# EAGLE design Groupe3_Hermant-Bohyn-Almasy-Ponjee (EAGLE 9.3.0)
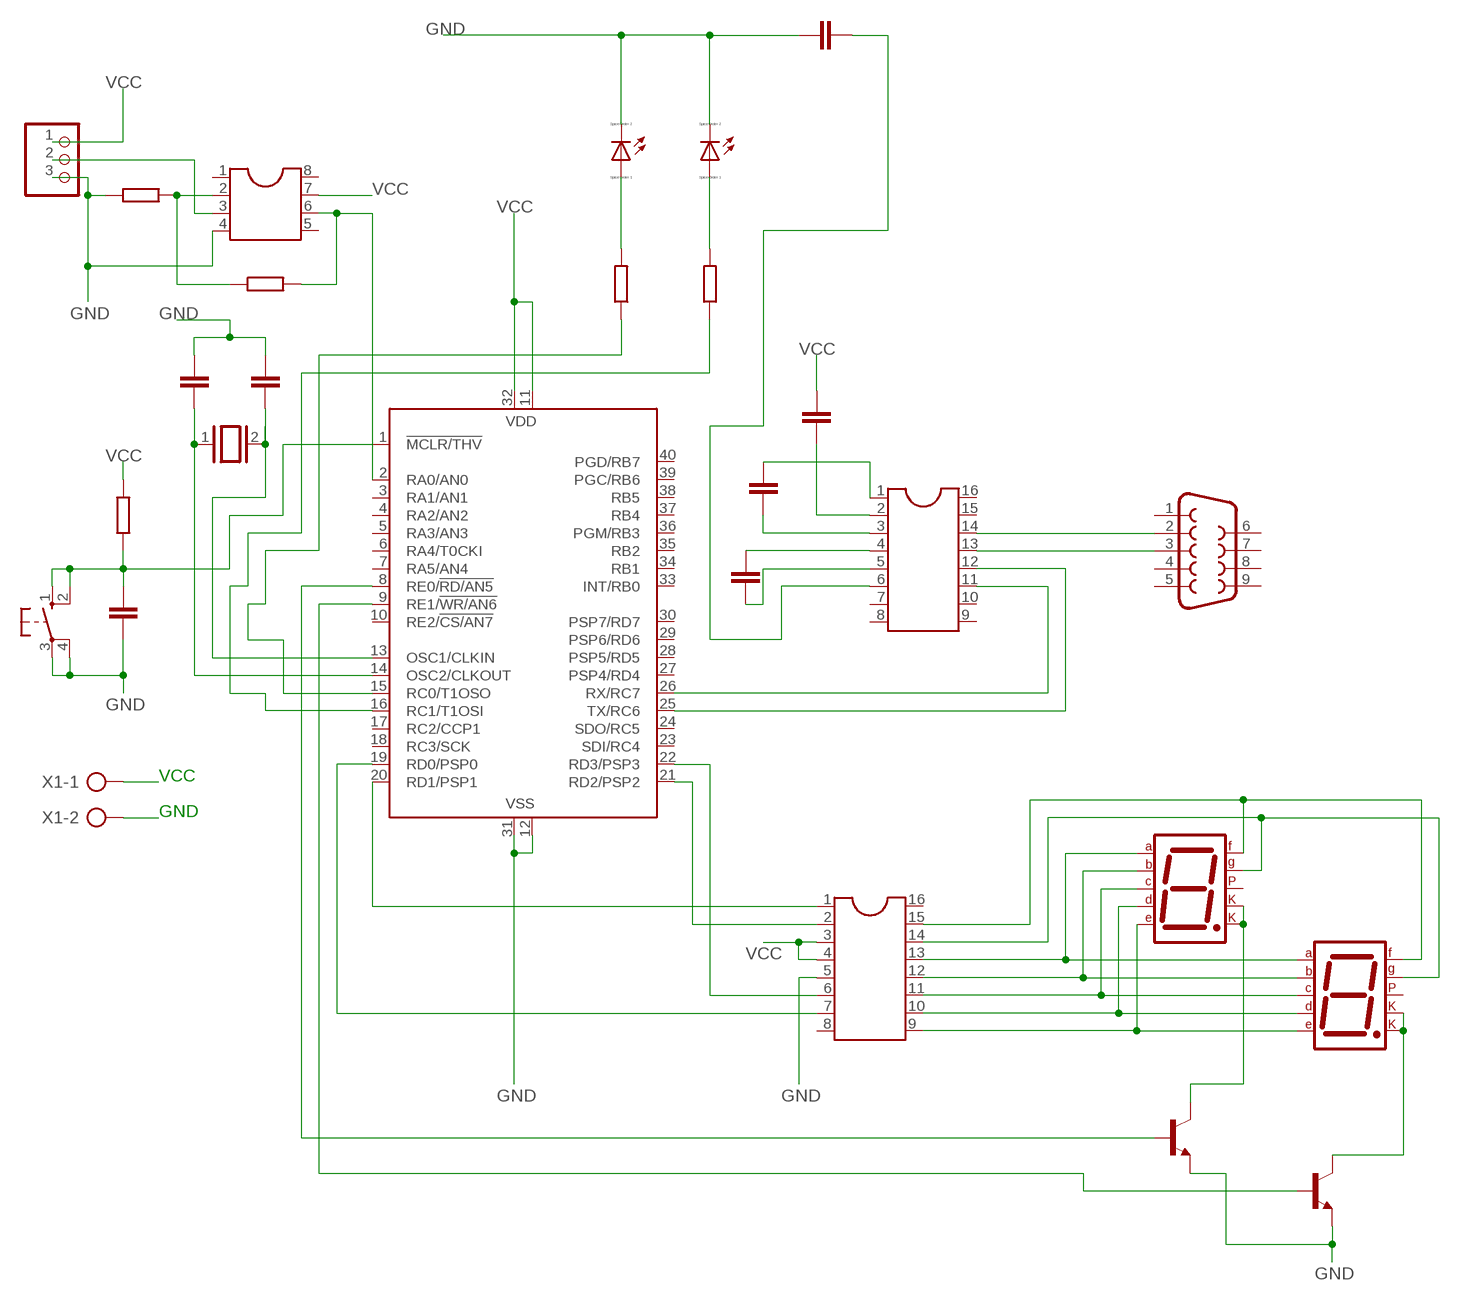
[diagram p0: schematic, sheet 1]

## Parts
4511  DIL16  [DIL16]
AMPLIOP  DIL8  [DIL08]
C1  15pF  C-EU025-050X050  [C025-050X050]
C2  15pF  C-EU025-050X050  [C025-050X050]
C3  1uF  C-EU025-050X050  [C025-050X050]
C4  10uF  C-EU025-050X050  [C025-050X050]
C5  10uF  C-EU025-050X050  [C025-050X050]
C7  100u  C-EU025-050X050  [C025-050X050]
C61  10uF  C-EU025-050X050  [C025-050X050]
D1  7SEG-CK  [7SEG-13]
D2  7SEG-CK  [7SEG-13]
LED1  LED_ELD260  [LED_LD260]
LED2  LED_ELD260  [LED_LD260]
LM35  PINHD-1X3  [1X03]
MAX232  DIL16  [DIL16]
P1/COMPIM  F09V  [F09V]
Q1  2N2222  [TO18]
Q2  2N2222  [TO18]
R1  10k  R-EU_0204/7  [0204/7]
R2  4k  R-EU_0204/7  [0204/7]
R3  1k  R-EU_0204/7  [0204/7]
R4  280  R-EU_0204/7  [0204/7]
R5  280  R-EU_0204/7  [0204/7]
S1  10-XX  [B3F-10XX]
U1  PIC16F877P  [DIL40]
X1  AK300/2  [AK300/2]
X11  XTAL/S  [QS]

## Nets
COMPIM: 4511.12 D1.6(B) D2.6(B)
GND: 4511.5 AMPLIOP.4 C1.1 C2.1 C3.1 C61.2 LED1.K(C) LED2.K(C) LM35.3 Q1.1(E) Q2.1(E) R2.1 S1.3(P) S1.4(P1) U1.12(VSS) U1.31(VSS) X1.2
N$2: C2.2 U1.14(OSC2/CLKOUT) X11.1
N$5: MAX232.14 P1/COMPIM.2
N$6: LED2.A R5.2
N$8: C1.2 U1.13(OSC1/CLKIN) X11.2
N$9: 4511.1 U1.20(RD1/PSP1)
N$10: LED1.A R4.2
N$11: MAX232.13 P1/COMPIM.3
N$12: C61.1 MAX232.6
N$13: R4.1 U1.15(RC0/T1OSO)
N$14: R5.1 U1.16(RC1/T1OSI)
N$15: C7.1 MAX232.2
N$18: C4.1 MAX232.3
N$21: C4.2 MAX232.1
N$22: C5.2 MAX232.4
N$24: C5.1 MAX232.5
N$25: C3.2 R1.1 S1.1(S) S1.2(S1) U1.1(!MCLR/THV)
N$26: 4511.7 U1.19(RD0/PSP0)
N$27: D1.3(CK1) D1.8(CK2) Q1.3(C)
N$28: 4511.2 U1.21(RD2/PSP2)
N$29: 4511.6 U1.22(RD3/PSP3)
N$30: AMPLIOP.3 LM35.2
N$31: MAX232.12 U1.25(TX/RC6)
N$32: MAX232.11 U1.26(RX/RC7)
N$33: Q1.2(B) U1.8(RE0/!RD/AN5)
N$34: AMPLIOP.2 R2.2 R3.1
N$35: AMPLIOP.6 R3.2 U1.2(RA0/AN0)
N$36: 4511.13 D1.7(A) D2.7(A)
N$37: 4511.10 D1.2(D) D2.2(D)
N$38: 4511.11 D1.4(C) D2.4(C)
N$39: 4511.9 D1.1(E) D2.1(E)
N$44: 4511.14 D1.10(G) D2.10(G)
N$47: D2.3(CK1) D2.8(CK2) Q2.3(C)
N$48: Q2.2(B) U1.9(RE1/!WR/AN6)
N$53: 4511.15 D1.9(F) D2.9(F)
VCC: 4511.3 4511.4 AMPLIOP.7 C7.2 LM35.1 R1.2 U1.11(VDD) U1.32(VDD) X1.1
Unconnected: 4511.8 4511.16 AMPLIOP.1 AMPLIOP.5 AMPLIOP.8 D1.5(DP) D2.5(DP) MAX232.7 MAX232.8 MAX232.9 MAX232.10 MAX232.15 MAX232.16 P1/COMPIM.1 P1/COMPIM.4 P1/COMPIM.5 P1/COMPIM.6 P1/COMPIM.7 P1/COMPIM.8 P1/COMPIM.9 U1.3(RA1/AN1) U1.4(RA2/AN2) U1.5(RA3/AN3) U1.6(RA4/T0CKI) U1.7(RA5/AN4) U1.10(RE2/!CS/AN7) U1.17(RC2/CCP1) U1.18(RC3/SCK) U1.23(SDI/RC4) U1.24(SDO/RC5) U1.27(PSP4/RD4) U1.28(PSP5/RD5) U1.29(PSP6/RD6) U1.30(PSP7/RD7) U1.33(INT/RB0) U1.34(RB1) U1.35(RB2) U1.36(PGM/RB3) U1.37(RB4) U1.38(RB5) U1.39(PGC/RB6) U1.40(PGD/RB7)

## Library data of the parts
4511 MAX232 = ic-package:DIL16: Dual In Line / Socket
AMPLIOP = ic-package:DIL8: Dual In Line / Socket
C1-C5 C7 C61 = rcl:C-EU: CAPACITOR, European symbol
D1 D2 = special:7SEG-CK: 7-segment DISPLAY single cathode, 13 mm
LED1 LED2 = eagle-ltspice:LED_E: LED Source: http://www.osram.convergy.de Source: www.luxeon.com Source: www.kingbright.com; SPICEMODEL: NONE; SPICEPREFIX: D; SPICETYPE: diode
LM35 = pinhead:PINHD-1X3: PIN HEADER
P1/COMPIM = con-subd:F09: SUB-D; OC_FARNELL: unknown; OC_NEWARK: unknown
Q1 Q2 = transistor:2N2222: NPN TRANSISTOR
R1-R5 = rcl:R-EU_: RESISTOR, European symbol
S1 = switch-omron:10-XX: OMRON SWITCH; MPN: B3F-1000; OC_FARNELL: 176432; OC_NEWARK: 36M3542
U1 = microchip:PIC16F87*: MICROCONTROLLER; MF: MICROCHIP; MPN: PIC16F877-04/P; OC_FARNELL: 9761349; OC_NEWARK: 61K3463
X1 = con-ptr500:AK300/2: CONNECTOR; OC_FARNELL: unknown; OC_NEWARK: unknown
X11 = special:XTAL/S: CRYSTAL

## Board
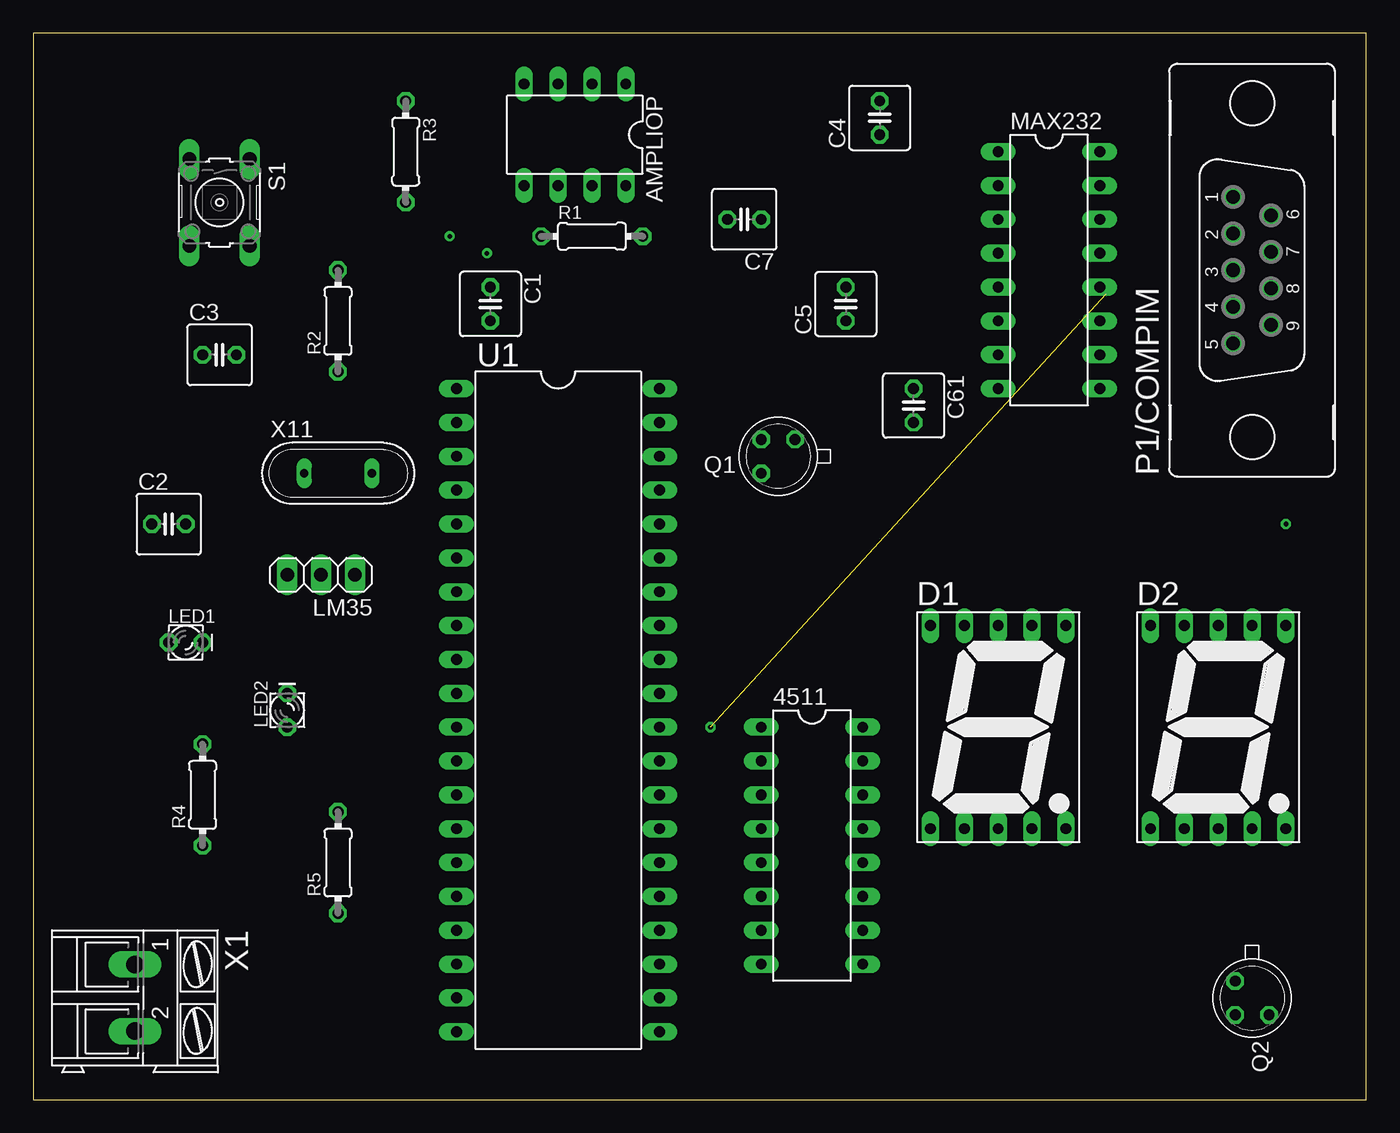
[diagram p1: board, top side]
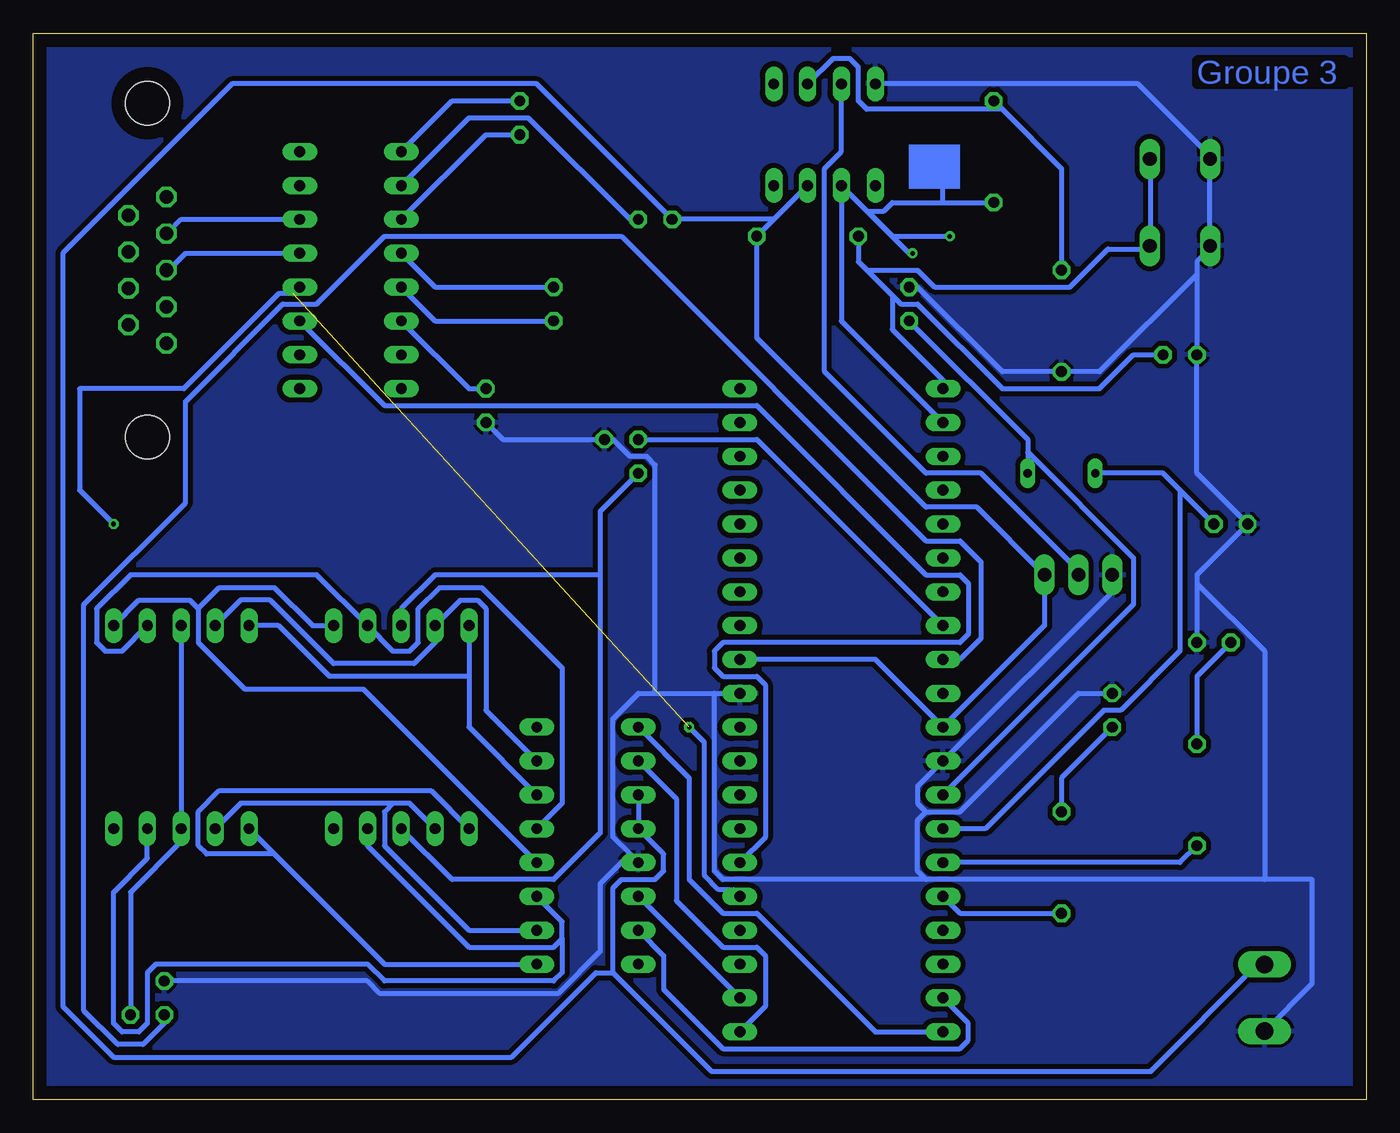
[diagram p2: board, bottom side, seen from below]

Size 100 x 80 mm. Coordinates in mm from the lower left corner, seen from the top.
Outline: 0,0 100,0 100,80 0,80 0,0
Copper layers (1*16): Top 0.035mm / dielectric 1.5mm / Bottom 0.035mm
Design rules "default *": minimum track width 15mil, minimum drill 0.35mm, track to track 15mil, track to pad 15mil, pad to pad 15mil, via to via 15mil, smd to smd 6mil, copper to edge 40mil, drill to drill 6mil, minimum pad ring 10mil, minimum via ring 8mil, stop-mask expansion 4mil, vias tented up to drill 0mil, thermal gap 10mil

### Footprints (pad centres in the part's own frame; a part is rotated, then mirrored left to right if it is on the bottom)
DIL16 = drill 0.813 long: 1 -8.89,-3.81; 2 -6.35,-3.81; 3 -3.81,-3.81; 4 -1.27,-3.81; 5 1.27,-3.81; 6 3.81,-3.81; 7 6.35,-3.81; 8 8.89,-3.81; 9 8.89,3.81; 10 6.35,3.81; 11 3.81,3.81; 12 1.27,3.81; 13 -1.27,3.81; 14 -3.81,3.81; 15 -6.35,3.81; 16 -8.89,3.81
DIL08 = drill 0.813 long: 1 -3.81,-3.81; 2 -1.27,-3.81; 3 1.27,-3.81; 4 3.81,-3.81; 5 3.81,3.81; 6 1.27,3.81; 7 -1.27,3.81; 8 -3.81,3.81
C025-050X050 = drill 0.813 octagon: 1 -1.27,0; 2 1.27,0
7SEG-13 = drill 0.813 long: 1 -5.08,-7.62; 2 -2.54,-7.62; 3 0,-7.62; 4 2.54,-7.62; 5 5.08,-7.62; 6 5.08,7.62; 7 2.54,7.62; 8 0,7.62; 9 -2.54,7.62; 10 -5.08,7.62
LED_LD260 = drill 0.813 octagon: A -1.27,0; K 1.27,0
1X03 = drill 1.016 long: 1 -2.54,0; 2 0,0; 3 2.54,0
F09V = drill 1.016 octagon: 1 5.486,1.422; 2 2.743,1.422; 3 0,1.422; 4 -2.743,1.422; 5 -5.486,1.422; 6 4.115,-1.422; 7 1.372,-1.422; 8 -1.372,-1.422; 9 -4.115,-1.422 | hole 3.302: -12.522,0; 12.522,0
TO18 = drill 0.813 octagon: 1 -1.27,-1.27; 2 1.27,-1.27; 3 1.27,1.27
0204/7 = drill 0.813 octagon: 1 -3.81,0; 2 3.81,0
B3F-10XX = drill 1.016 long: 1 -3.251,2.261; 2 3.251,2.261; 3 -3.251,-2.261; 4 3.251,-2.261
DIL40 = drill 0.813 long: 1 -24.13,-7.62; 2 -21.59,-7.62; 3 -19.05,-7.62; 4 -16.51,-7.62; 5 -13.97,-7.62; 6 -11.43,-7.62; 7 -8.89,-7.62; 8 -6.35,-7.62; 9 -3.81,-7.62; 10 -1.27,-7.62; 11 1.27,-7.62; 12 3.81,-7.62; 13 6.35,-7.62; 14 8.89,-7.62; 15 11.43,-7.62; 16 13.97,-7.62; 17 16.51,-7.62; 18 19.05,-7.62; 19 21.59,-7.62; 20 24.13,-7.62; 21 24.13,7.62; 22 21.59,7.62; 23 19.05,7.62; 24 16.51,7.62; 25 13.97,7.62; 26 11.43,7.62; 27 8.89,7.62; 28 6.35,7.62; 29 3.81,7.62; 30 1.27,7.62; 31 -1.27,7.62; 32 -3.81,7.62; 33 -6.35,7.62; 34 -8.89,7.62; 35 -11.43,7.62; 36 -13.97,7.62; 37 -16.51,7.62; 38 -19.05,7.62; 39 -21.59,7.62; 40 -24.13,7.62
AK300/2 = drill 1.321 long: 1 -2.515,0; 2 2.489,0
QS = drill 0.61 long: 1 -2.54,0; 2 2.54,0

### Placement (x,y rotation side)
4511  58.42,19.05 270 top
AMPLIOP  40.64,72.39 180 top
C1  34.29,59.69 270 top
C2  10.16,43.18 0 top
C3  13.97,55.88 0 top
C4  63.5,73.66 90 top
C5  60.96,59.69 90 top
C7  10uF  [C025-050X050]  53.34,66.04 180 top
C61  66.04,52.07 270 top
D1  72.39,27.94 0 top
D2  88.9,27.94 0 top
LED1  11.43,34.29 0 top
LED2  19.05,29.21 90 top
LM35  21.59,39.37 180 top
MAX232  76.2,62.23 270 top
P1/COMPIM  91.44,62.23 90 top
Q1  55.88,48.26 180 top
Q2  91.44,7.62 270 top
R1  41.91,64.77 0 top
R2  22.86,58.42 90 top
R3  27.94,71.12 270 top
R4  12.7,22.86 90 top
R5  22.86,17.78 90 top
S1  13.97,67.31 270 top
U1  39.37,29.21 270 top
X1  7.62,7.62 270 top
X11  22.86,46.99 0 top

### Tracks (layer width: path | path; a pad name or v marks a point on that pad's centre or on a via)
COMPIM
  Bottom 0.381: 4511.12 75.25,30.8 84.14,30.8 87.63,34.29 87.63,36.83 | 87.63,36.83 88.27,37.47 92.08,37.47 D2.6 | D1.6 79.06,35.56 81.92,38.42 86.04,38.42 87.63,36.83
GND
  Bottom 0.381: C61.2 64.77,49.53 Q1.1 56.52,49.53 55.24,48.26 53.98,48.26 53.34,47.62 53.34,30.48 | 53.34,30.48 54.61,30.48 56.52,28.57 56.52,19.68 55.24,18.41 | 53.34,30.48 48.9,30.48 | 48.9,30.48 U1.31 | Q2.1 74.93,8.89 73.98,7.94 60.64,7.94 57.47,11.11 57.47,16.19 55.24,18.41 | 55.24,18.41 4511.5 | AMPLIOP.4 17.14,76.2 11.75,70.8 S1.3 11.75,70.48 11.75,64.14 S1.4 11.75,63.82 12.7,62.87 12.7,61.91 | 12.7,61.91 C3.1 12.7,46.99 C2.1 12.7,39.37 12.7,38.73 | 12.7,61.91 20,54.61 R2.1 27.3,54.61 33.66,60.96 C1.1 | LM35.3 19.05,38.1 U1.12 33.66,23.5 33.66,22.23 33.02,21.59 | LED2.K 21.59,30.48 30.48,21.59 33.02,21.59 | 12.7,38.73 LED1.K | 7.62,16.51 7.62,33.66 12.7,38.73 | X1.2 4.06,8.69 4.06,16.51 7.62,16.51 | 33.02,21.59 33.66,20.95 33.66,17.14 33.02,16.51 | 7.62,16.51 33.02,16.51 | 48.9,30.48 48.9,17.14 48.26,16.51 33.02,16.51
  pour Bottom (isolate 0.02): 0,80.01 100.08,80.01 100.08,0 0,0
N$2
  Bottom 0.381: X11.1 15.24,46.99 13.97,45.72 | C2.2 13.97,45.72 | U1.14 28.57,20.32 19.68,29.21 18.41,29.21 13.97,33.66 13.97,45.72
N$5
  Bottom 0.381: MAX232.14 88.9,66.04 89.85,65.09 P1/COMPIM.2
N$6
  Bottom 0.381: R5.2 22.86,24.13 LED2.A
N$8
  Bottom 0.381: 25.4,48.58 25.4,49.53 C1.2 | 25.4,48.58 X11.2 | U1.13 17.46,37.15 17.46,40.64 25.4,48.58
N$9
  Bottom 0.381: U1.20 36.83,5.08 45.72,13.97 48.26,13.97 50.8,16.51 50.8,24.13 4511.1
N$10
  Bottom 0.381: R4.2 12.7,31.75 LED1.A
N$11
  Bottom 0.381: MAX232.13 88.58,63.5 89.85,62.23 P1/COMPIM.3
N$12
  Bottom 0.381: C61.1 67.31,53.34 MAX232.6
N$13
  Bottom 0.381: U1.15 13.97,17.78 R4.1
N$14
  Bottom 0.381: R5.1 30.48,13.97 U1.16
N$15
  Bottom 0.381: C7.1 55.24,66.04 62.87,73.66 67.31,73.66 MAX232.2
N$18
  Bottom 0.381: C4.1 66.04,72.39 MAX232.3
N$21
  Bottom 0.381: C4.2 68.58,74.93 MAX232.1
N$22
  Bottom 0.381: C5.2 69.85,60.96 MAX232.4
N$24
  Bottom 0.381: C5.1 69.85,58.42 MAX232.5
N$25
  Bottom 0.381: S1.1 16.19,70.48 16.19,64.14 S1.2 16.51,63.82 19.37,63.82 22.23,60.96 32.38,60.96 33.66,62.23 37.47,62.23 | C3.2 17.46,55.88 20,53.34 27.3,53.34 33.66,59.69 34.92,59.69 35.56,60.33 | 37.47,62.23 38.1,62.87 R1.1 | 37.47,62.23 35.56,60.33 | U1.1 31.75,53.98 35.56,57.78 35.56,60.33
N$26
  Bottom 0.381: U1.19 29.84,5.71 29.84,4.45 30.48,3.81 48.26,3.81 52.7,8.26 52.7,10.79 4511.7
N$27
  Bottom 0.381: D1.3 68.58,16.51 60.96,16.51 57.47,20 57.47,39.37 | 57.47,39.37 57.47,44.13 Q1.3 | D1.8 72.39,36.83 69.85,39.37 57.47,39.37
N$28
  Bottom 0.381: U1.21 45.09,6.99 45.09,10.79 45.72,11.43 48.26,11.43 51.75,14.92 51.75,22.54 4511.2
N$29
  Bottom 0.381: 4511.6 U1.22
N$30
  Bottom 0.381: AMPLIOP.3 39.37,71.12 40.64,69.85 40.64,54.61 33.02,46.99 28.89,46.99 21.59,39.69 LM35.2
N$31  (via drill 0.35)  (1 unrouted)
  Bottom 0.381: U1.25 47.5,15.75 48.58,15.75 49.66,16.83 49.66,26.8 v50.8,27.94 | MAX232.12 80.52,60.45 81.6,60.45 88.71,53.34 96.52,53.34 96.52,45.72 v93.98,43.18
N$32
  Bottom 0.381: U1.26 45.09,19.68 45.09,31.11 45.72,31.75 48.26,31.75 48.9,32.38 48.9,33.66 48.26,34.29 30.48,34.29 29.84,34.92 29.84,38.73 30.48,39.37 33.02,39.37 45.72,52.07 73.66,52.07 MAX232.11
N$33
  Bottom 0.381: U1.8 45.72,49.53 Q1.2
N$34
  Bottom 0.381: R2.2 22.86,69.85 27.3,74.3 | R3.1 27.3,74.3 | AMPLIOP.2 40.01,78.11 38.73,78.11 38.1,77.47 38.1,74.93 37.47,74.3 27.3,74.3
N$35
  Bottom 0.381: 31.75,67.31 35.56,67.31 36.2,66.67 37.47,66.67 AMPLIOP.6 | 31.75,67.31 R3.2 | U1.2 39.37,58.42 AMPLIOP.6 | AMPLIOP.6 35.56,64.77 31.5,64.77 | AMPLIOP.6 34.29,63.5 33.97,63.5 | 31.75,67.31 31.75,68.83
N$36
  Bottom 0.381: 4511.13 60.33,22.23 60.33,32.38 66.36,38.42 69.53,38.42 71.12,36.83 71.12,34.29 71.75,33.66 73.03,33.66 D1.7 78.74,39.37 92.71,39.37 95.25,36.83 95.25,34.29 94.61,33.66 93.34,33.66 D2.7
N$37
  Bottom 0.381: 4511.10 67.31,12.7 73.66,19.05 73.66,21.59 73.03,22.23 | 73.03,22.23 71.75,22.23 D1.2 | D2.2 84.45,22.23 73.03,22.23
N$38
  Bottom 0.381: 4511.11 60.33,13.34 60.33,12.06 | 60.33,12.06 60.96,11.43 67.31,11.43 74.93,19.05 D1.4 | D2.4 91.44,18.1 93.98,15.56 93.98,5.71 93.34,5.08 92.08,5.08 91.44,5.71 91.44,9.53 90.81,10.16 74.93,10.16 73.66,8.89 60.96,8.89 60.33,9.53 60.33,12.06
N$39
  Bottom 0.381: 4511.9 73.66,10.16 81.92,18.41 | D2.1 81.92,18.41 | D1.1 70.17,23.18 86.04,23.18 87.63,21.59 87.63,19.05 87,18.41 81.92,18.41
N$44
  Bottom 0.381: 4511.14 67.31,27.94 67.31,31.75 | D1.10 67.31,31.75 | D2.10 81.6,35.56 77.79,31.75 67.31,31.75
N$47
  Bottom 0.381: D2.8 D2.3 88.9,19.37 92.71,15.56 Q2.3
N$48
  Bottom 0.381: U1.9 30.48,33.02 28.89,34.61 28.89,40.32 30.48,41.91 33.02,41.91 55.88,64.77 73.66,64.77 78.74,59.69 81.28,59.69 88.58,52.39 88.58,44.77 96.2,37.15 96.2,6.67 93.66,4.13 91.76,4.13 90.17,5.71 Q2.2
N$53
  Bottom 0.381: 4511.15 66.04,29.21 66.04,36.83 66.67,37.47 67.94,37.47 D1.9 69.85,34.29 71.44,32.7 77.47,32.7 82.23,37.47 84.45,37.47 D2.9
S$1  (via drill 0.35)
  other vias: 31.24,64.77
S$2  (via drill 0.35)
  other vias: 34.04,63.5
VCC
  Bottom 0.381: 4511.3 4511.4 52.7,18.41 52.7,17.14 53.34,16.51 55.88,16.51 56.52,15.88 56.52,9.53 | 56.52,9.53 49.09,2.1 16.19,2.1 8.15,10.13 X1.1 | AMPLIOP.7 44.45,66.04 | 44.45,66.04 R1.2 45.72,57.15 33.02,44.45 29.21,44.45 LM35.1 24.13,35.56 U1.11 36.83,33.02 U1.32 | 44.45,66.04 C7.2 62.23,76.2 85.09,76.2 97.79,63.5 97.79,6.99 93.98,3.17 64.14,3.17 57.78,9.53 56.52,9.53
(copper drawn outside any net)
  shapes: Bottom area x1

### Text on the board
Bottom: Groupe 3